# Altium schematic sheet B_E-Label.SchDoc
size A4; DocumentNumber: 4; SheetNumber: 4; SheetTotal: 5
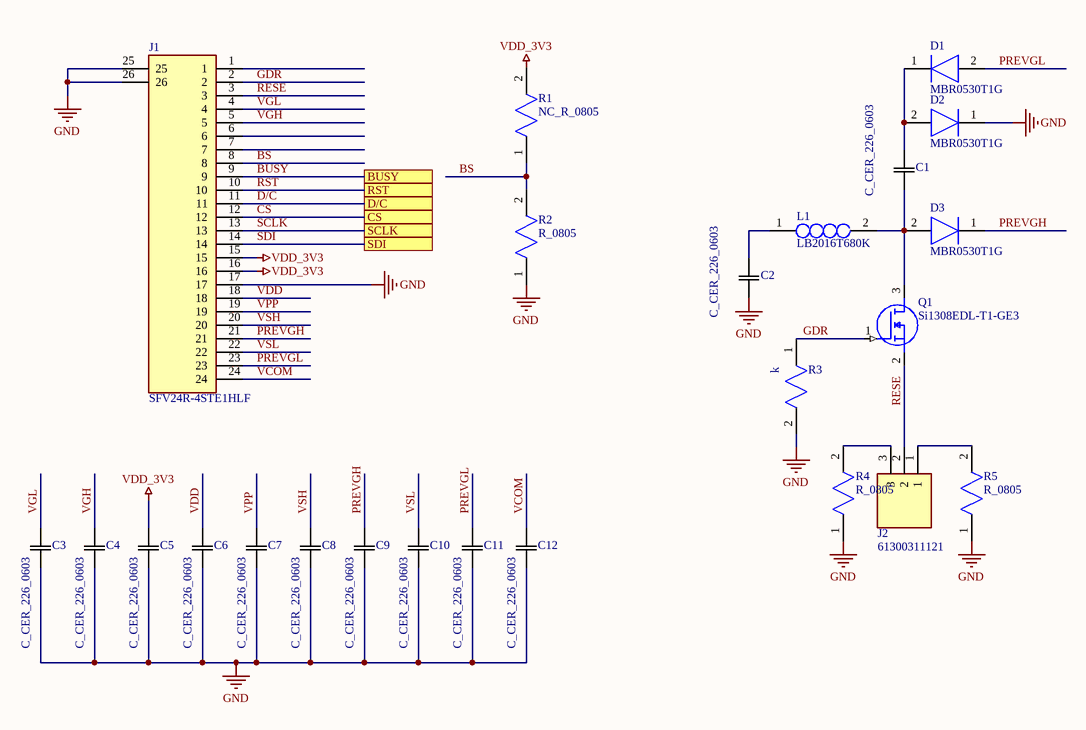
[diagram p0: B_E-Label.SchDoc]

## Parts
C1  C_CER_226_0603  [CAPC1608X90N]
C2  C_CER_226_0603  [CAPC1608X90N]
C3  C_CER_226_0603  [CAPC1608X90N]
C4  C_CER_226_0603  [CAPC1608X90N]
C5  C_CER_226_0603  [CAPC1608X90N]
C6  C_CER_226_0603  [CAPC1608X90N]
C7  C_CER_226_0603  [CAPC1608X90N]
C8  C_CER_226_0603  [CAPC1608X90N]
C9  C_CER_226_0603  [CAPC1608X90N]
C10  C_CER_226_0603  [CAPC1608X90N]
C11  C_CER_226_0603  [CAPC1608X90N]
C12  C_CER_226_0603  [CAPC1608X90N]
D1  MBR0530T1G  [SOD3716X135N]
D2  MBR0530T1G  [SOD3716X135N]
D3  MBR0530T1G  [SOD3716X135N]
J1  SFV24R-4STE1HLF  [SFV24R4STE1HLF]
J2  61300311121  [HDRV3W95P0X254_1X3_762X254X869P]
L1  LB2016T680K  [INDC2218X180N]
Q1  Si1308EDL-T1-GE3  [SOT65P210X110-3N]
R1  NC_R_0805  [RESC2012X55N]
R2  R_0805  [RESC2012X55N]
R3  k  [RESC1005X40N]
R4  R_0805  [RESC2012X55N]
R5  R_0805  [RESC2012X55N]

## Ports
BUSY, CS, D/C, RST, SCLK, SDI

## Nets
GND: C2.1 C3.1 C4.1 C5.1 C6.1 C7.1 C8.1 C9.1 C10.1 C11.1 C12.1 D2.1(K) J1.17 J1.25 J1.26 R2.1 R3.2 R4.1 R5.1
VDD_3V3: C5.2 J1.15 J1.16 R1.2
BS: J1.8 R1.1 R2.2
BUSY: J1.9 ; port BUSY
CS: J1.12 ; port CS
D/C: J1.11 ; port D/C
GDR: J1.2 Q1.1(G) R3.1
PREVGH: C9.2 D3.1(K) J1.21
PREVGL: C11.2 D1.2(A) J1.23
RESE: J1.3 J2.2 Q1.2(S)
RST: J1.10 ; port RST
SCLK: J1.13 ; port SCLK
SDI: J1.14 ; port SDI
VCOM: C12.2 J1.24
VDD: C6.2 J1.18
VGH: C4.2 J1.5
VGL: C3.2 J1.4
VPP: C7.2 J1.19
VSH: C8.2 J1.20
VSL: C10.2 J1.22
NetC1_1: C1.1 D3.2(A) L1.2 Q1.3(D)
NetC1_2: C1.2 D1.1(K) D2.2(A)
NetC2_2: C2.2 L1.1
NetJ2_1: J2.1 R5.2
NetJ2_3: J2.3 R4.2

Not connected (* = marked no-connect by the designer): J1 1 6 7

## Library data of the parts
C1-C12 = C_CER_226_0603: Manufacturer_Part_Number: GRM188R60J226MEA0D; Vendor: Murata; SourceLibrary: Murata_2014-12-31; Type: DEV; Copyright: Copyright (C) 2015 Accelerated Designs. All rights reserved; RefDes: RefDes
D1-D3 = MBR0530T1G: Diode; Manufacturer_Name: ON Semiconductor; Datasheet Link: https://componentsearchengine.com//MBR0530T1G.pdf; Height: 1.35mm; Mouser2 Part Number: 863-MBR0530T1G; Mouser2 Price/Stock: https://www.mouser.com/Search/Refine.aspx?Keyword=863-MBR0530T1G; Manufacturer_Part_Number: MBR0530T1G
J1 = SFV24R-4STE1HLF: Connector; Manufacturer_Name: Amphenol; Datasheet Link: https://www.mouser.co.uk/datasheet/2/18/10117319-1361747.pdf; Height: 2mm; Manufacturer_Part_Number: SFV24R-4STE1HLF
J2 = 61300311121: Connector; Manufacturer_Name: Wurth Elektronik; Datasheet Link: https://componentsearchengine.com//61300311121.pdf; Height: 8.69mm; Mouser2 Part Number: 710-61300311121; Mouser2 Price/Stock: https://www.mouser.com/Search/Refine.aspx?Keyword=710-61300311121; Manufacturer_Part_Number: 61300311121
L1 = LB2016T680K: Inductor; Manufacturer_Name: TAIYO YUDEN; Datasheet Link: https://www.arrow.com/en/products/lb2016t680k/taiyo-yuden; Height: 1.8mm; Manufacturer_Part_Number: LB2016T680K; Arrow Part Number: LB2016T680K
Q1 = Si1308EDL-T1-GE3: MOSFET (N-Channel); Manufacturer_Name: Vishay; Datasheet Link: https://componentsearchengine.com//SI1308EDL-T1-GE3.pdf; Height: 1.1mm; Mouser2 Part Number: 78-SI1308EDL-T1-GE3; Mouser2 Price/Stock: https://www.mouser.com/Search/Refine.aspx?Keyword=78-SI1308EDL-T1-GE3; Manufacturer_Part_Number: Si1308EDL-T1-GE3
R1 R2 R4 R5 = R_0805: Resistor; Manufacturer_Name: Vishay; Datasheet Link: http://www.vishay.com/docs/20035/dcrcwe3.pdf; Height: 0.4mm
R3 = CRCW0402100KFKED: Resistor; Manufacturer_Name: Vishay; Datasheet Link: http://www.vishay.com/docs/20035/dcrcwe3.pdf; Height: 0.4mm; Manufacturer_Part_Number: CRCW0402100KFKED